# EAGLE design ledDriver_v2 (EAGLE 8.7.0)
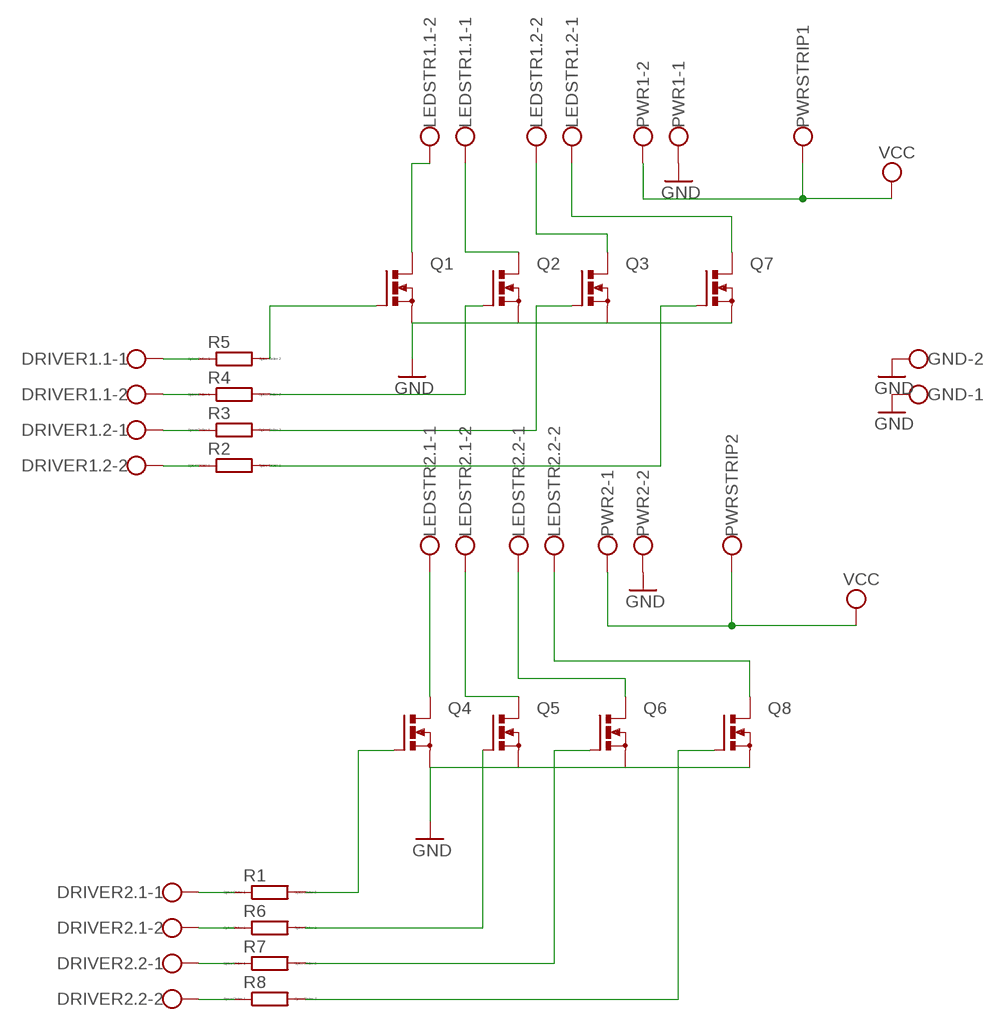
[diagram p0: schematic, sheet 1]

## Parts
DRIVER1.1  W237-102  [W237-102]
DRIVER1.2  W237-102  [W237-102]
DRIVER2.1  W237-102  [W237-102]
DRIVER2.2  W237-102  [W237-102]
GND  W237-102  [W237-102]
LEDSTR1.1  W237-102  [W237-102]
LEDSTR1.2  W237-102  [W237-102]
LEDSTR2.1  W237-102  [W237-102]
LEDSTR2.2  W237-102  [W237-102]
PWR1  W237-102  [W237-102]
PWR2  W237-102  [W237-102]
PWRSTRIP1  W237-112  [W237-112]
PWRSTRIP2  W237-112  [W237-112]
Q1  PMOSFET_NTO220BV  [TO220BV]
Q2  PMOSFET_NTO220BV  [TO220BV]
Q3  PMOSFET_NTO220BV  [TO220BV]
Q4  PMOSFET_NTO220BV  [TO220BV]
Q5  PMOSFET_NTO220BV  [TO220BV]
Q6  PMOSFET_NTO220BV  [TO220BV]
Q7  PMOSFET_NTO220BV  [TO220BV]
Q8  PMOSFET_NTO220BV  [TO220BV]
R1  R0207/10  [0207/10]
R2  R0207/10  [0207/10]
R3  R0207/10  [0207/10]
R4  R0207/10  [0207/10]
R5  R0207/10  [0207/10]
R6  R0207/10  [0207/10]
R7  R0207/10  [0207/10]
R8  R0207/10  [0207/10]

## Nets
GND: GND.1 GND.2 PWR1.1 PWR2.2 Q1.S Q2.S Q3.S Q4.S Q5.S Q6.S Q7.S Q8.S
N$1: LEDSTR2.1.1 Q4.D
N$2: LEDSTR2.1.2 Q5.D
N$3: LEDSTR1.1.2 Q1.D
N$4: LEDSTR1.1.1 Q2.D
N$5: LEDSTR1.2.2 Q3.D
N$6: LEDSTR1.2.1 Q7.D
N$7: LEDSTR2.2.1 Q6.D
N$8: LEDSTR2.2.2 Q8.D
N$9: Q6.G R7.2
N$10: Q8.G R8.2
N$11: Q1.G R5.2
N$12: Q2.G R4.2
N$13: Q3.G R3.2
N$14: Q7.G R2.2
N$15: Q4.G R1.2
N$16: Q5.G R6.2
N$17: DRIVER1.1.1 R5.1
N$18: DRIVER1.1.2 R4.1
N$19: DRIVER1.2.1 R3.1
N$20: DRIVER1.2.2 R2.1
N$21: DRIVER2.1.1 R1.1
N$22: DRIVER2.1.2 R6.1
N$23: DRIVER2.2.1 R7.1
N$27: DRIVER2.2.2 R8.1
VCC1: PWR1.2 PWRSTRIP1.1(KL) ; supply symbol labelled VCC
VCC2: PWR2.1 PWRSTRIP2.1(KL) ; supply symbol labelled VCC

## Library data of the parts
DRIVER1.1 DRIVER1.2 DRIVER2.1 DRIVER2.2 GND LEDSTR1.1 LEDSTR1.2 LEDSTR2.1 LEDSTR2.2 PWR1 PWR2 = con-wago-500:W237-102: WAGO SCREW CLAMP; MPN: 237-102; OC_FARNELL: unknown; OC_NEWARK: 70K9898
PWRSTRIP1 PWRSTRIP2 = con-wago-500:W237-112: WAGO SCREW CLAMP; MPN: 237-112; OC_FARNELL: unknown; OC_NEWARK: 76R2974
Q1-Q8 = transistor-power:PMOSFET_N: Power MOSFET N-Channel
R1-R8 = eagle-ltspice:R: RESISTOR, European symbol; SPICEMODEL: NONE; SPICEPREFIX: R

## Board
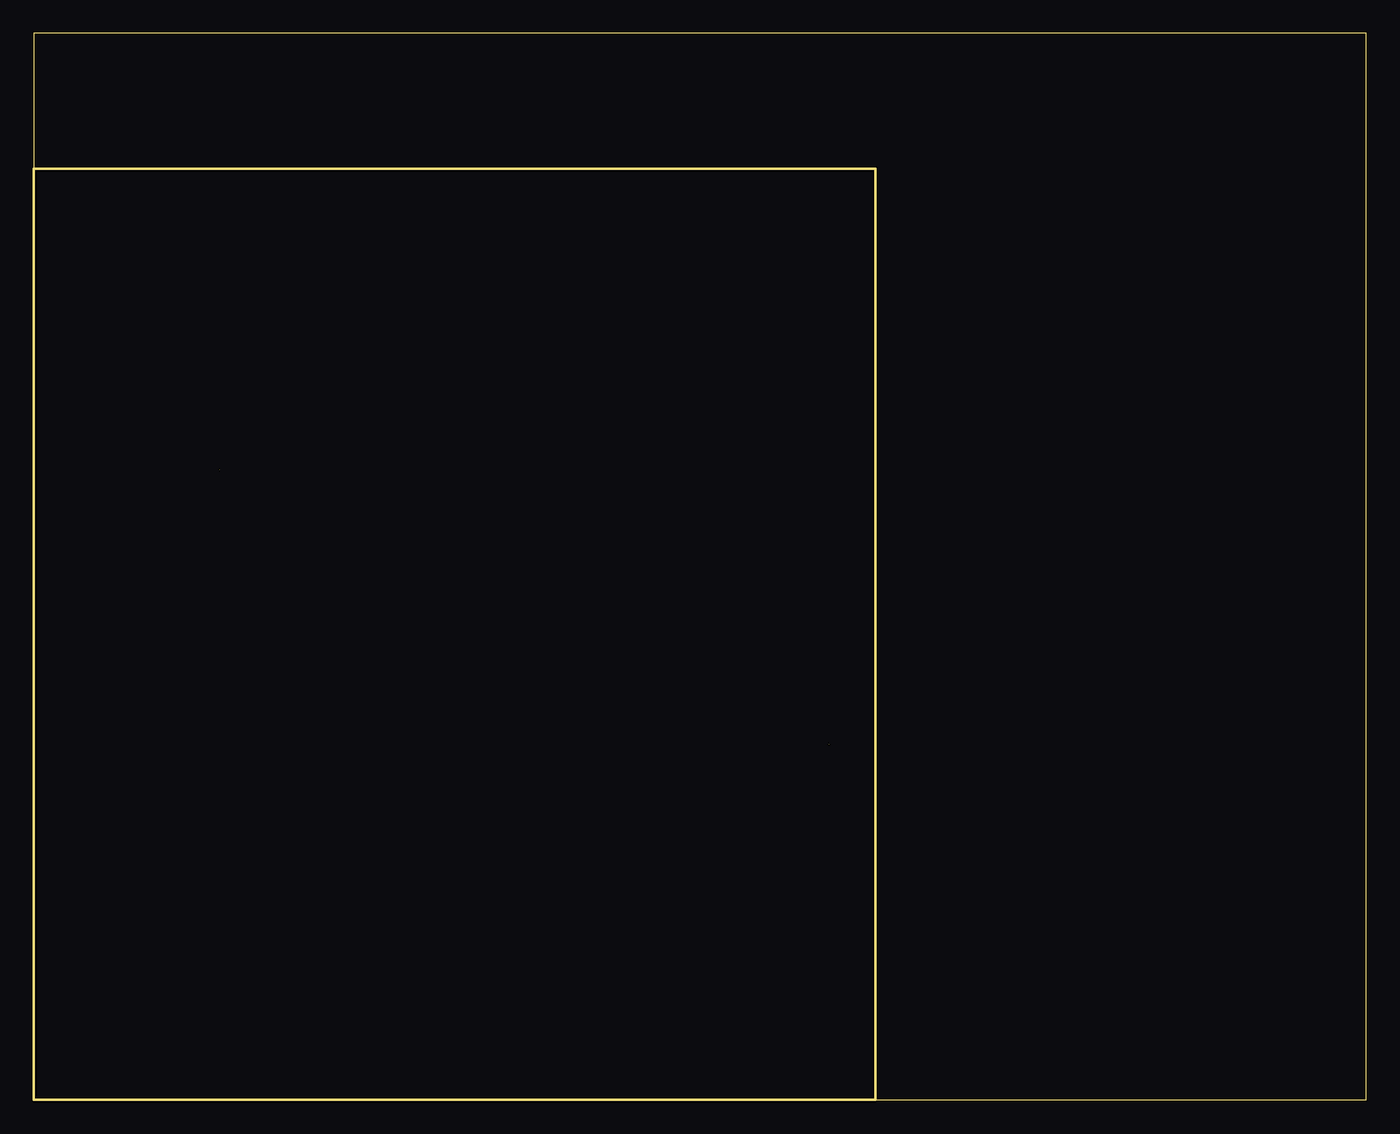
[diagram p1: board, top side]
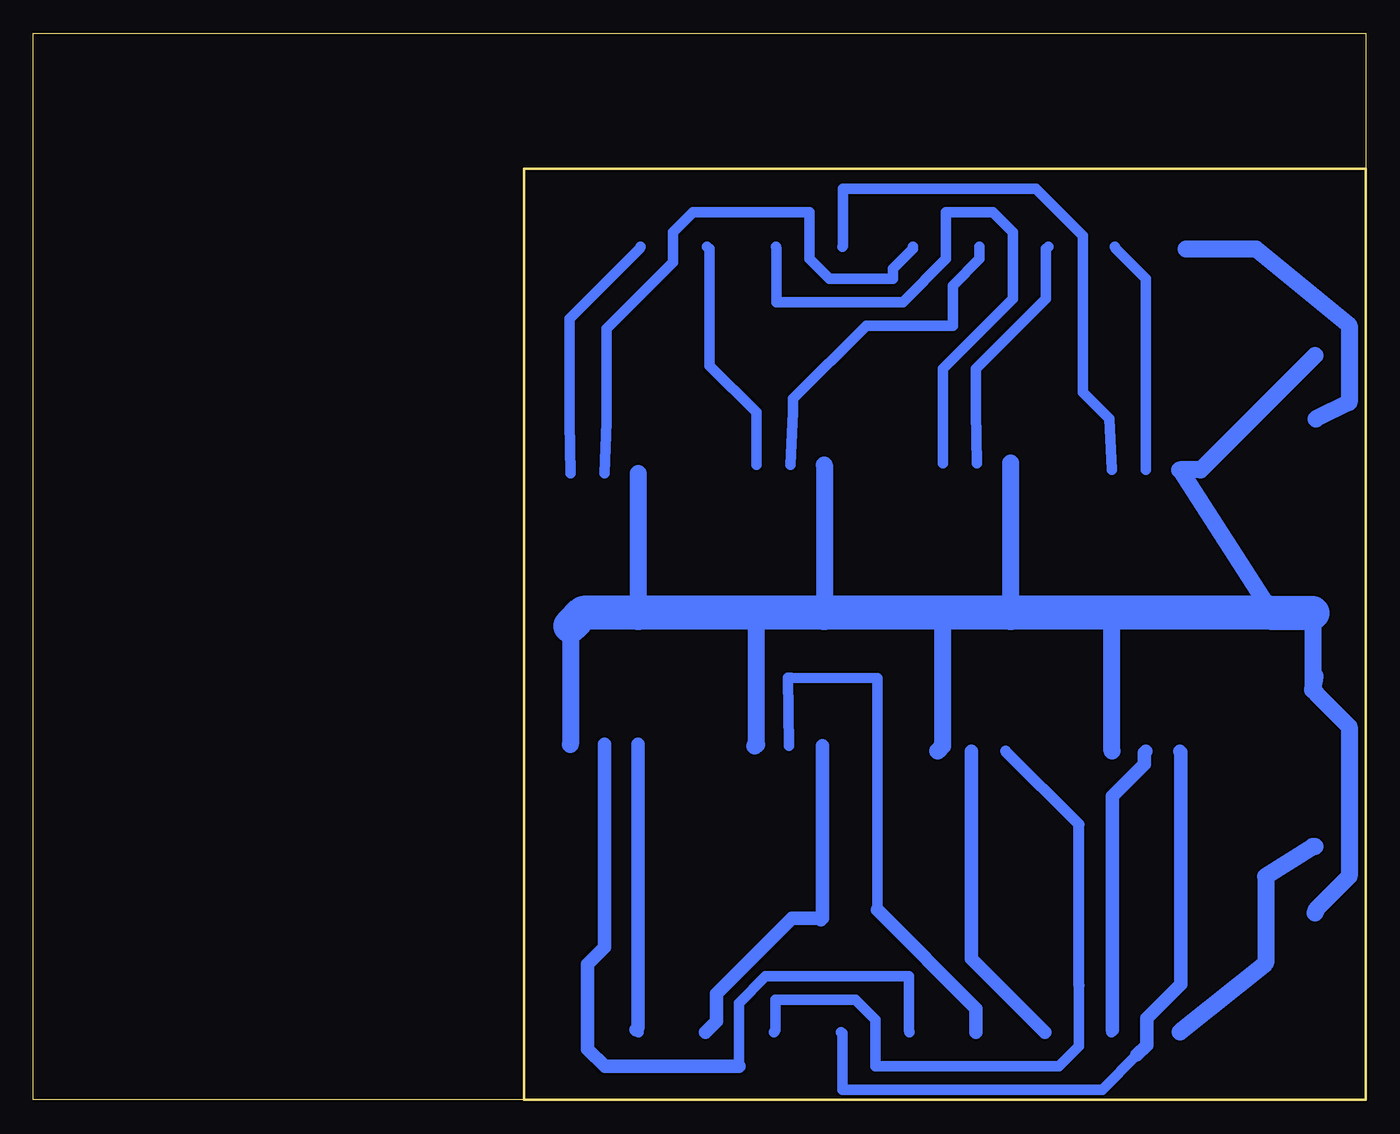
[diagram p2: board, bottom side, seen from below]

Size 100 x 80 mm. Coordinates in mm from the lower left corner, seen from the top.
Outline: 0,0 100,0 100,80 0,80 0,0
Outline: 0,0 63.17,0 63.17,69.84 0,69.84 0,0
Copper layers (1*16): Top 0.035mm / dielectric 1.5mm / Bottom 0.035mm
Design rules "default": minimum track width 6mil, minimum drill 0.35mm, track to track 6mil, track to pad 6mil, pad to pad 6mil, via to via 6mil, smd to smd 6mil, copper to edge 40mil, drill to drill 6mil, minimum pad ring 10mil, minimum via ring 8mil, stop-mask expansion 4mil, vias tented up to drill 0mil, thermal gap 10mil

### Footprints (pad centres in the part's own frame; a part is rotated, then mirrored left to right if it is on the bottom)
W237-102 = drill 1.194 long: 1 -2.5,-1.27; 2 2.5,-1.27
W237-112 = drill 1.194 long: 1 2.5,-1.27
TO220BV = drill 1.016 long: D 0,-2.54; G -2.54,-2.54; S 2.54,-2.54
0207/10 = drill 0.813 octagon: 1 -5.08,0; 2 5.08,0

### Placement (x,y rotation side)
DRIVER1.1  -41.91,16.51 0 top  (outside the outline)
DRIVER1.2  -53.34,16.51 0 top  (outside the outline)
DRIVER2.1  -19.05,26.67 0 top  (outside the outline)
DRIVER2.2  -30.48,26.67 0 top  (outside the outline)
GND  -40.64,26.67 0 top  (outside the outline)
LEDSTR1.1  -44.45,6.35 0 top  (outside the outline)
LEDSTR1.2  -55.88,6.35 0 top  (outside the outline)
LEDSTR2.1  -19.05,16.51 0 top  (outside the outline)
LEDSTR2.2  -30.48,16.51 0 top  (outside the outline)
PWR1  -50.8,26.67 0 top  (outside the outline)
PWR2  -17.78,36.83 0 top  (outside the outline)
PWRSTRIP1  -20.32,6.35 0 top  (outside the outline)
PWRSTRIP2  -33.02,6.35 0 top  (outside the outline)
Q1  -29.21,38.1 0 top  (outside the outline)
Q2  -40.64,38.1 0 top  (outside the outline)
Q3  -52.07,38.1 0 top  (outside the outline)
Q4  -19.05,48.26 0 top  (outside the outline)
Q5  -30.48,48.26 0 top  (outside the outline)
Q6  -41.91,48.26 0 top  (outside the outline)
Q7  -53.34,48.26 0 top  (outside the outline)
Q8  -19.05,55.88 0 top  (outside the outline)
R1  -31.75,50.8 0 top  (outside the outline)
R2  -44.45,50.8 0 top  (outside the outline)
R3  -57.15,50.8 0 top  (outside the outline)
R4  -19.05,58.42 0 top  (outside the outline)
R5  -31.75,58.42 0 top  (outside the outline)
R6  -44.45,58.42 0 top  (outside the outline)
R7  -57.15,58.42 0 top  (outside the outline)
R8  -19.05,63.5 0 top  (outside the outline)

### Tracks (layer width: path | path; a pad name or v marks a point on that pad's centre or on a via)
GND  (11 unrouted)
GND1  (2 unrouted)
  Bottom 0.8: 3.75,30.5 3.81,31.79
  Bottom 1.27: 3.75,30.5 1.25,28 1.25,16.75 3.75,14.25 3.81,14.01 | 3.81,31.79 4,30.75 4,36.52 3.81,36.79 | 3.81,55.84 12.41,47.24 13.97,47.24 7.05,36.52 | 59.69,35.56 59.69,26.67 | 54.61,46.99 54.61,36.52 | 40.64,47.62 40.64,36.52 | 45.85,26.54 45.72,26.67 45.72,36.52 | 32.13,26.16 31.75,26.54 31.75,36.52 | 26.67,47.75 26.67,36.52 | 19.05,26.16 19.05,36.52
  Bottom 2.54: 4,36.52 7.05,36.52 19.05,36.52 26.67,36.52 31.75,36.52 40.64,36.52 45.72,36.52 54.61,36.52 58.73,36.52 59.69,35.56
N$1  (1 unrouted)
N$2  (1 unrouted)
N$3  (1 unrouted)
N$4  (1 unrouted)
N$5  (1 unrouted)
N$6  (1 unrouted)
N$7  (1 unrouted)
N$8  (1 unrouted)
N$9  (1 unrouted)
N$10  (1 unrouted)
N$11  (1 unrouted)
N$12  (1 unrouted)
N$13  (1 unrouted)
N$14  (1 unrouted)
N$15  (1 unrouted)
N$16  (1 unrouted)
N$17  (1 unrouted)
N$18  (1 unrouted)
N$19  (1 unrouted)
N$20  (1 unrouted)
N$21  (1 unrouted)
N$22  (1 unrouted)
N$23  (1 unrouted)
N$24
  Bottom 0.8: 16.51,47.24 16.5,51.08 16.5,61.58 18.75,63.83 18.84,64.01
N$25
  Bottom 0.8: 29.21,47.75 29.25,51.58 29.25,54.83 24,60.08 24,63.83 23.84,64.01
N$26
  Bottom 0.8: 43.18,47.62 43,51.58 43,52.58 37.5,58.08 31,58.08 31,61.08 29,63.08 29,63.83 29,64.01
N$27  (1 unrouted)
N$28
  Bottom 0.8: 57.15,46.99 57,50.83 57,57.83 52,62.83 52,65.08 50.5,66.58 41.75,66.58 41.75,63.08 40.25,61.58 35.5,61.58 35.5,62.33 34,63.83 34,64.01
N$29
  Bottom 0.8: 19.04,5.25 19.09,5.08
  Bottom 1.016: 16.51,26.16 16.63,26.04 16.63,25.16 19.04,22.75 19.04,5.25
N$30
  Bottom 1.016: 29.59,26.16 29.59,10.58 24.09,5.08
N$31
  Bottom 0.8: 36.66,14.24 36.67,31.64 43.13,31.66 43.38,31.68 43.31,26.54
  Bottom 1.016: 36.66,14.24 29.25,6.83 29.25,5.08
N$32
  Bottom 0.8: 47.04,2.5 47.04,7.25 45.04,9.25 34.29,9.25 34.29,5.25 34.25,5.08
  Bottom 1.016: 47.04,2.5 57.11,2.5 58.42,3.81 58.42,10.16 57.15,11.43 57.15,26.67
N$33
  Bottom 0.8: 19.05,47.24 19.25,51.08 21.25,53.08 21.25,64.83 24.75,68.33 39.25,68.33 39.25,64.08 39.28,64.01
N$34
  Bottom 0.8: 31.75,47.75 31.75,54.83 26.5,60.08 26.5,65.08 28,66.58 31.5,66.58 31.5,63.08 34.75,59.83 44.25,59.83 44.25,63.83 44.28,64.01
N$35
  Bottom 0.8: 45.72,47.62 45.75,51.58 49.25,55.08 49.25,63.83 49.44,64.01
N$36
  Bottom 0.8: 59.69,46.99 59.75,50.83 59.75,58.58 54.5,63.83 54.44,64.01
N$37
  Bottom 0.8: 13.87,12.38 13.98,11.71 | 17.18,3.37 19.79,0.75 39.29,0.75 39.29,5 39.41,5.08
  Bottom 1.016: 13.97,26.16 13.87,26.07 13.87,12.38 13.87,8.68 16.43,6.12 16.43,4.11 17.18,3.37
N$38
  Bottom 0.8: 21.54,8.56 21.54,4 23.04,2.5 36.79,2.5 36.79,6 38.29,7.5 44.29,7.5 44.29,5.25 44.41,5.08
  Bottom 0.813: 21.54,8.56 21.54,20.65 27.05,26.16
N$39
  Bottom 1.016: 40.77,26.54 40.77,13.63 | 40.77,13.63 40.88,13.52 | 49.57,5.08 48.75,5.9 48.75,7.96 43.08,13.63 40.77,13.63
N$40
  Bottom 0.8: 54.79,5.25 54.57,5.08
  Bottom 1.016: 54.61,26.67 54.61,5.43 54.79,5.25
VCC1  (1 unrouted)
VCC2  (1 unrouted)
VCC3
  Bottom 1.27: 13.93,5.08 13.79,5.25 7.52,10.25 7.52,16.75 4,19 3.81,19.01
VCC4
  Bottom 0.8: 3.75,51.08 3.81,50.84 | 13.5,63.83 13.55,64.01
  Bottom 1.27: 3.75,51.08 1.25,52.31 1.25,58.1 8.25,63.83 13.5,63.83